# EAGLE design schem (EAGLE 9.4.0)
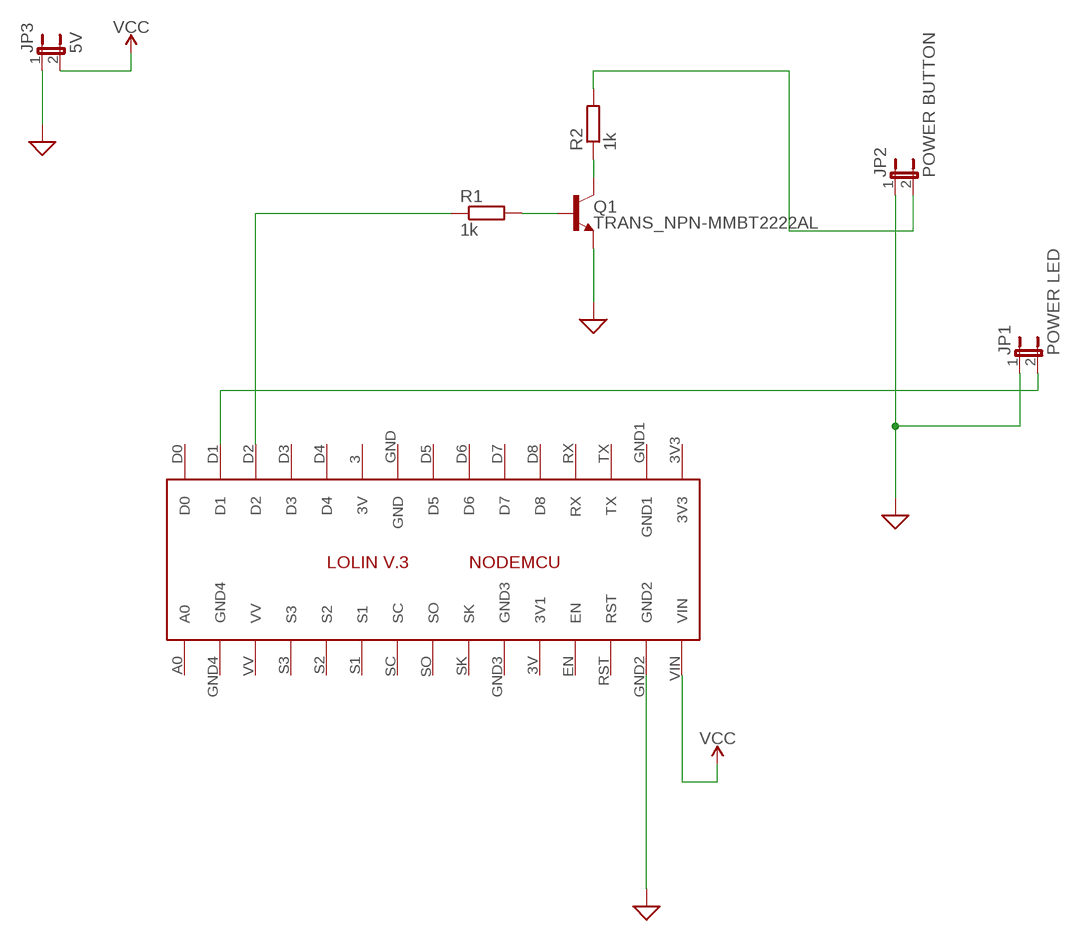
[diagram p0: schematic, sheet 1]

## Parts
IC1  LOLINV3  [LOLINV3]
JP1  POWER LED  JP1E  [JP1]
JP2  POWER BUTTON  JP1E  [JP1]
JP3  5V  JP1E  [JP1]
Q1  TRANS_NPN-MMBT2222AL  [SOT23-3]
R1  1k  R-EU_M0805  [M0805]
R2  1k  R-EU_M0805  [M0805]

## Nets
GND: IC1.GND2 JP1.1 JP2.1 JP3.1 Q1.2(E) ; supply symbol labelled SUP
N$1: IC1.D1 JP1.2
N$2: IC1.D2 R1.1
N$3: Q1.1(B) R1.2
N$4: Q1.3(C) R2.1
N$5: JP2.2 R2.2
VCC: IC1.VIN JP3.2
Unconnected: IC1.3(3V) IC1.3V3 IC1.3V(3V1) IC1.A0 IC1.D0 IC1.D3 IC1.D4 IC1.D5 IC1.D6 IC1.D7 IC1.D8 IC1.EN IC1.GND IC1.GND1 IC1.GND3 IC1.GND4 IC1.RST IC1.RX IC1.S1 IC1.S2 IC1.S3 IC1.SC IC1.SK IC1.SO IC1.TX IC1.VV

## Library data of the parts
IC1 = Lolin:LOLINV3
JP1-JP3 = jumper:JP1E: JUMPER
Q1 = SparkFun-DiscreteSemi:TRANS_NPN: NPN transistor Current controlled devices typically used to amplify current or used as a switch. BC547 - COM-08928 <http://www.sparkfun.com/products/8928> (TO-92 45V 100mA) (1.Collector 2.Base 3.Emitter) 2N3904 - COM-00521 <http://www.sparkfun.com/products/521> (TO-92 40V 200mA) (1.Emitter 2.Base 3.Collector) P2N2222A - COM-12852 <http://www.sparkfun.com/products/12852> (TO-92 40V 600mA) (1.Collector 2.Base 3.Emitter); PROD_ID: TRANS-08049; VALUE: 600mA/40V
R1 R2 = resistor:R-EU_: RESISTOR, European symbol

## Board
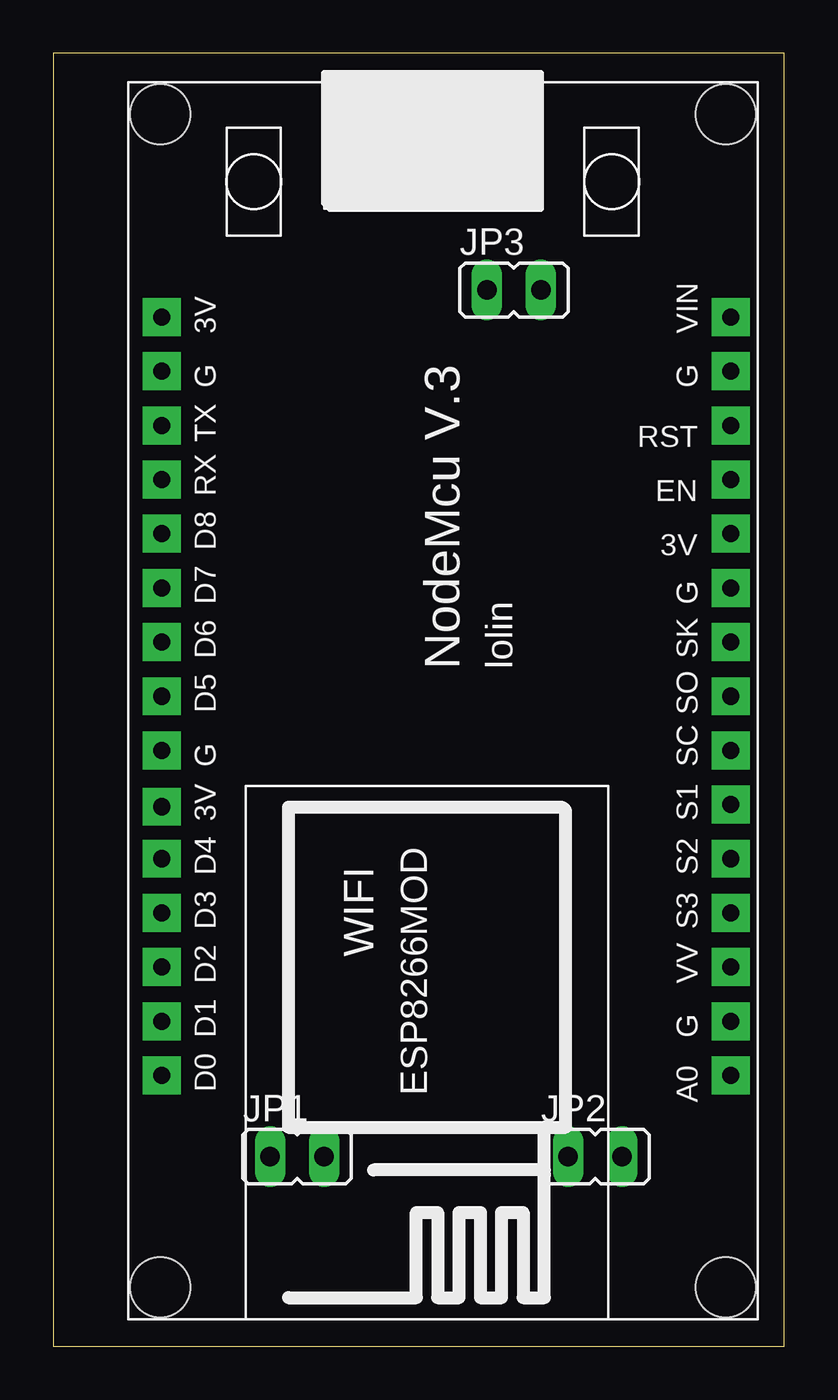
[diagram p1: board, top side]
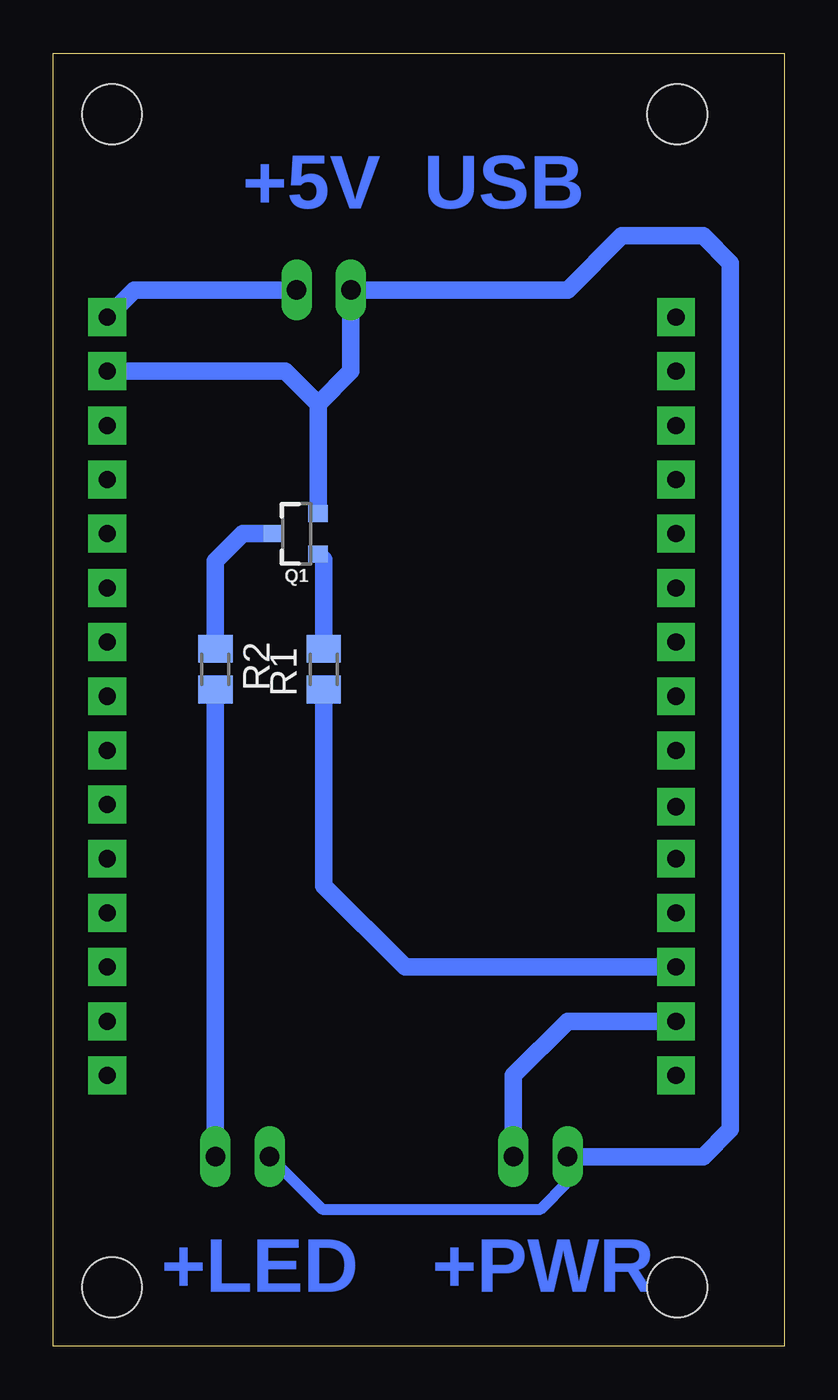
[diagram p2: board, bottom side, seen from below]

Size 34.27 x 60.63 mm. Coordinates in mm from the lower left corner, seen from the top.
Outline: 0,0 34.27,0 34.27,60.63 0,60.63 0,0
Copper layers (1*16): Top 0.035mm / dielectric 1.5mm / Bottom 0.035mm
Design rules "default": minimum track width 6mil, minimum drill 0.35mm, track to track 6mil, track to pad 6mil, pad to pad 6mil, via to via 6mil, smd to smd 6mil, copper to edge 40mil, drill to drill 6mil, minimum pad ring 10mil, minimum via ring 8mil, stop-mask expansion 4mil, vias tented up to drill 0mil, thermal gap 10mil

### Footprints (pad centres in the part's own frame; a part is rotated, then mirrored left to right if it is on the bottom)
LOLINV3 = drill 0.8 pad 1.778 square: 3 24.03,27.94; 3V 46.99,27.94; 3V3 36.83,1.27; A0 11.43,1.27; D0 11.43,27.94; D1 13.97,27.94; D2 16.51,27.94; D3 19.05,27.94; D4 21.59,27.94; D5 29.21,27.94; D6 31.75,27.94; D7 34.29,27.94; D8 36.83,27.94; EN 39.37,1.27; GND 26.67,27.94; GND1 44.45,27.94; GND2 44.45,1.27; GND3 34.29,1.27; GND4 13.97,1.27; RST 41.91,1.27; RX 39.37,27.94; S1 24.13,1.27; S2 21.59,1.27; S3 19.05,1.27; SC 26.67,1.27; SK 31.75,1.27; SO 29.21,1.27; TX 41.91,27.94; VIN 46.99,1.27; VV 16.51,1.27 | hole 2.8: 56.5,28; 56.5,1.5; 1.5,1.5; 1.5,28
JP1 = drill 0.914 long: 1 0,-1.27; 2 0,1.27
SOT23-3 = smd 0.8 x 0.9: 1 -0.95,-1; 2 0.95,-1; 3 0,1.1
M0805 = smd 1.3 x 1.6: 1 -0.95,0; 2 0.95,0

### Placement (x,y rotation side)
IC1  33.02,1.27 90 top
JP1  11.43,8.89 270 top
JP2  25.4,8.89 270 top
JP3  21.59,49.53 270 top
Q1  22.86,38.1 90 bottom
R1  21.59,31.75 90 bottom
R2  26.67,31.75 270 bottom

### Tracks (layer width: path | path; a pad name or v marks a point on that pad's centre or on a via)
GND
  Bottom 0.508: JP2.1 21.67,6.43 11.43,6.43 10.16,7.7 JP1.1
  Bottom 0.813: Q1.2 21.86,44.18 | 21.86,44.18 20.32,45.72 JP3.1 10.16,49.53 7.62,52.07 3.81,52.07 2.54,50.8 2.54,10.16 3.81,8.89 JP1.1 | IC1.GND2 23.4,45.72 21.86,44.18
N$1
  Bottom 0.813: JP1.2 12.7,12.7 10.16,15.24 IC1.D1
N$2
  Bottom 0.813: IC1.D2 17.78,17.78 21.59,21.59 R1.1
N$3
  Bottom 0.813: Q1.1 21.59,36.88 R1.2
N$4
  Bottom 0.813: R2.1 26.67,36.83 25.4,38.1 Q1.3
N$5
  Bottom 0.813: JP2.2 R2.2
VCC
  Bottom 0.813: IC1.VIN 30.48,49.53 JP3.2

### Text on the board
Bottom: +5V USB | +PWR | +LED